# Altium schematic sheet GENN0003.SchDoc
size A
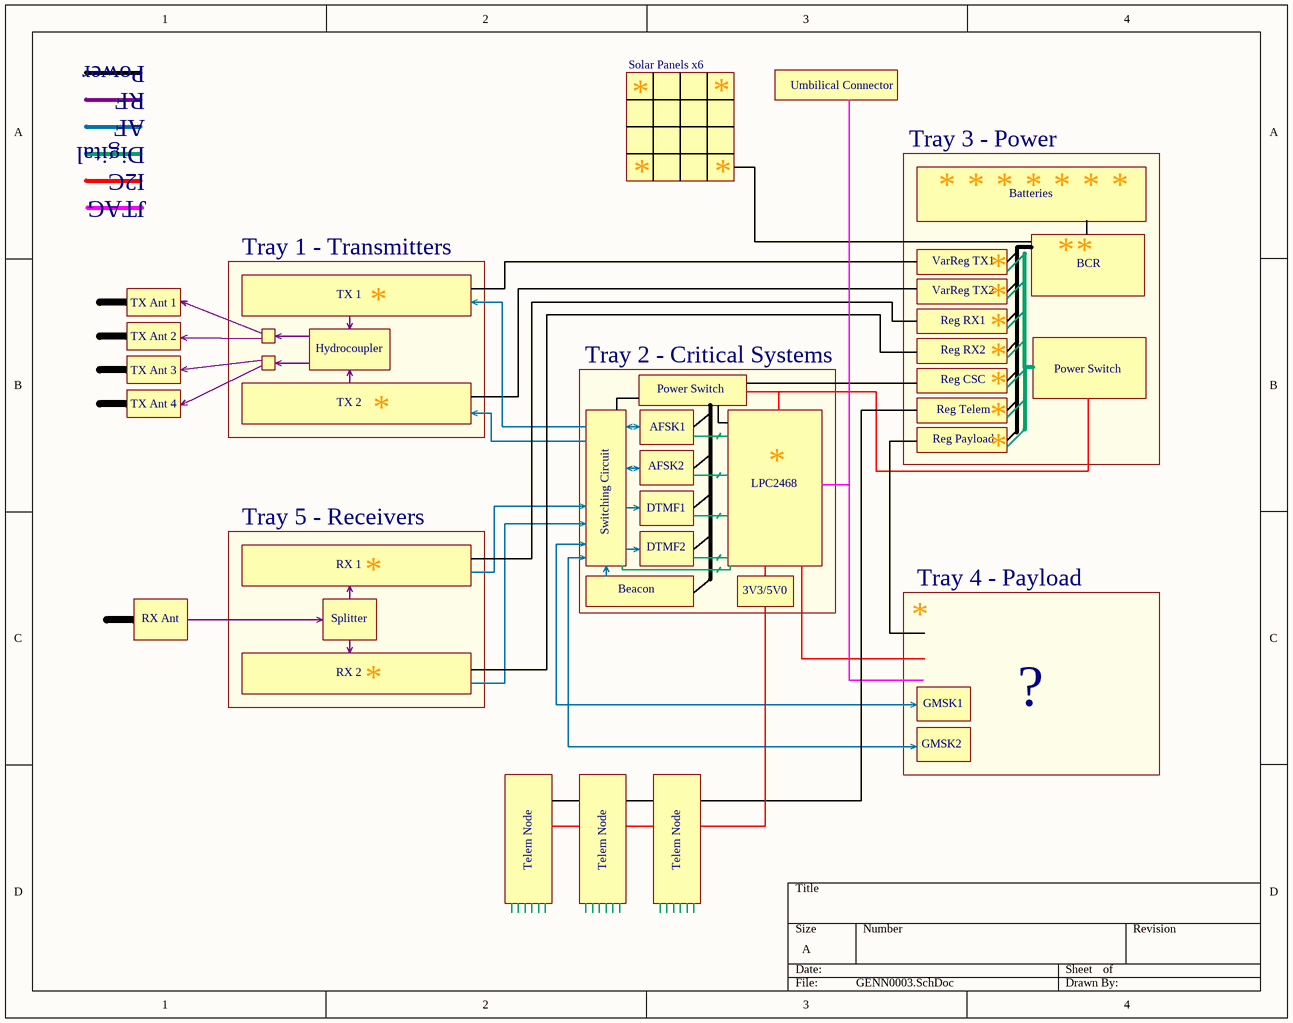
[diagram p0: GENN0003.SchDoc]

## Notes on the sheet
- Power
- RF
- Solar Panels x6
- Umbilical Connector
- AF
- Digital
- I2C
- *
- Tray 3 - Power
- JTAG
- Batteries
- Tray 1 - Transmitters
- TX 1
- VarReg TX1
- VarReg TX2
- BCR
- TX Ant 1
- TX Ant 2
- Hydrocoupler
- Tray 2 - Critical Systems
- Reg RX1
- Reg RX2
- Power Switch
- TX Ant 3
- TX Ant 4
- TX 2
- AFSK1
- Reg CSC
- Reg Telem
- Switching Circuit
- AFSK2
- LPC2468
- Reg Payload
- Tray 5 - Receivers
- RX 1
- DTMF1
- DTMF2
- RX Ant
- Splitter
- Beacon
- 3V3/5V0
- Tray 4 - Payload
- RX 2
- GMSK1
- GMSK2
- ?
- Telem Node